# EAGLE design NinjaPool-171009 (EAGLE 6.6.0)
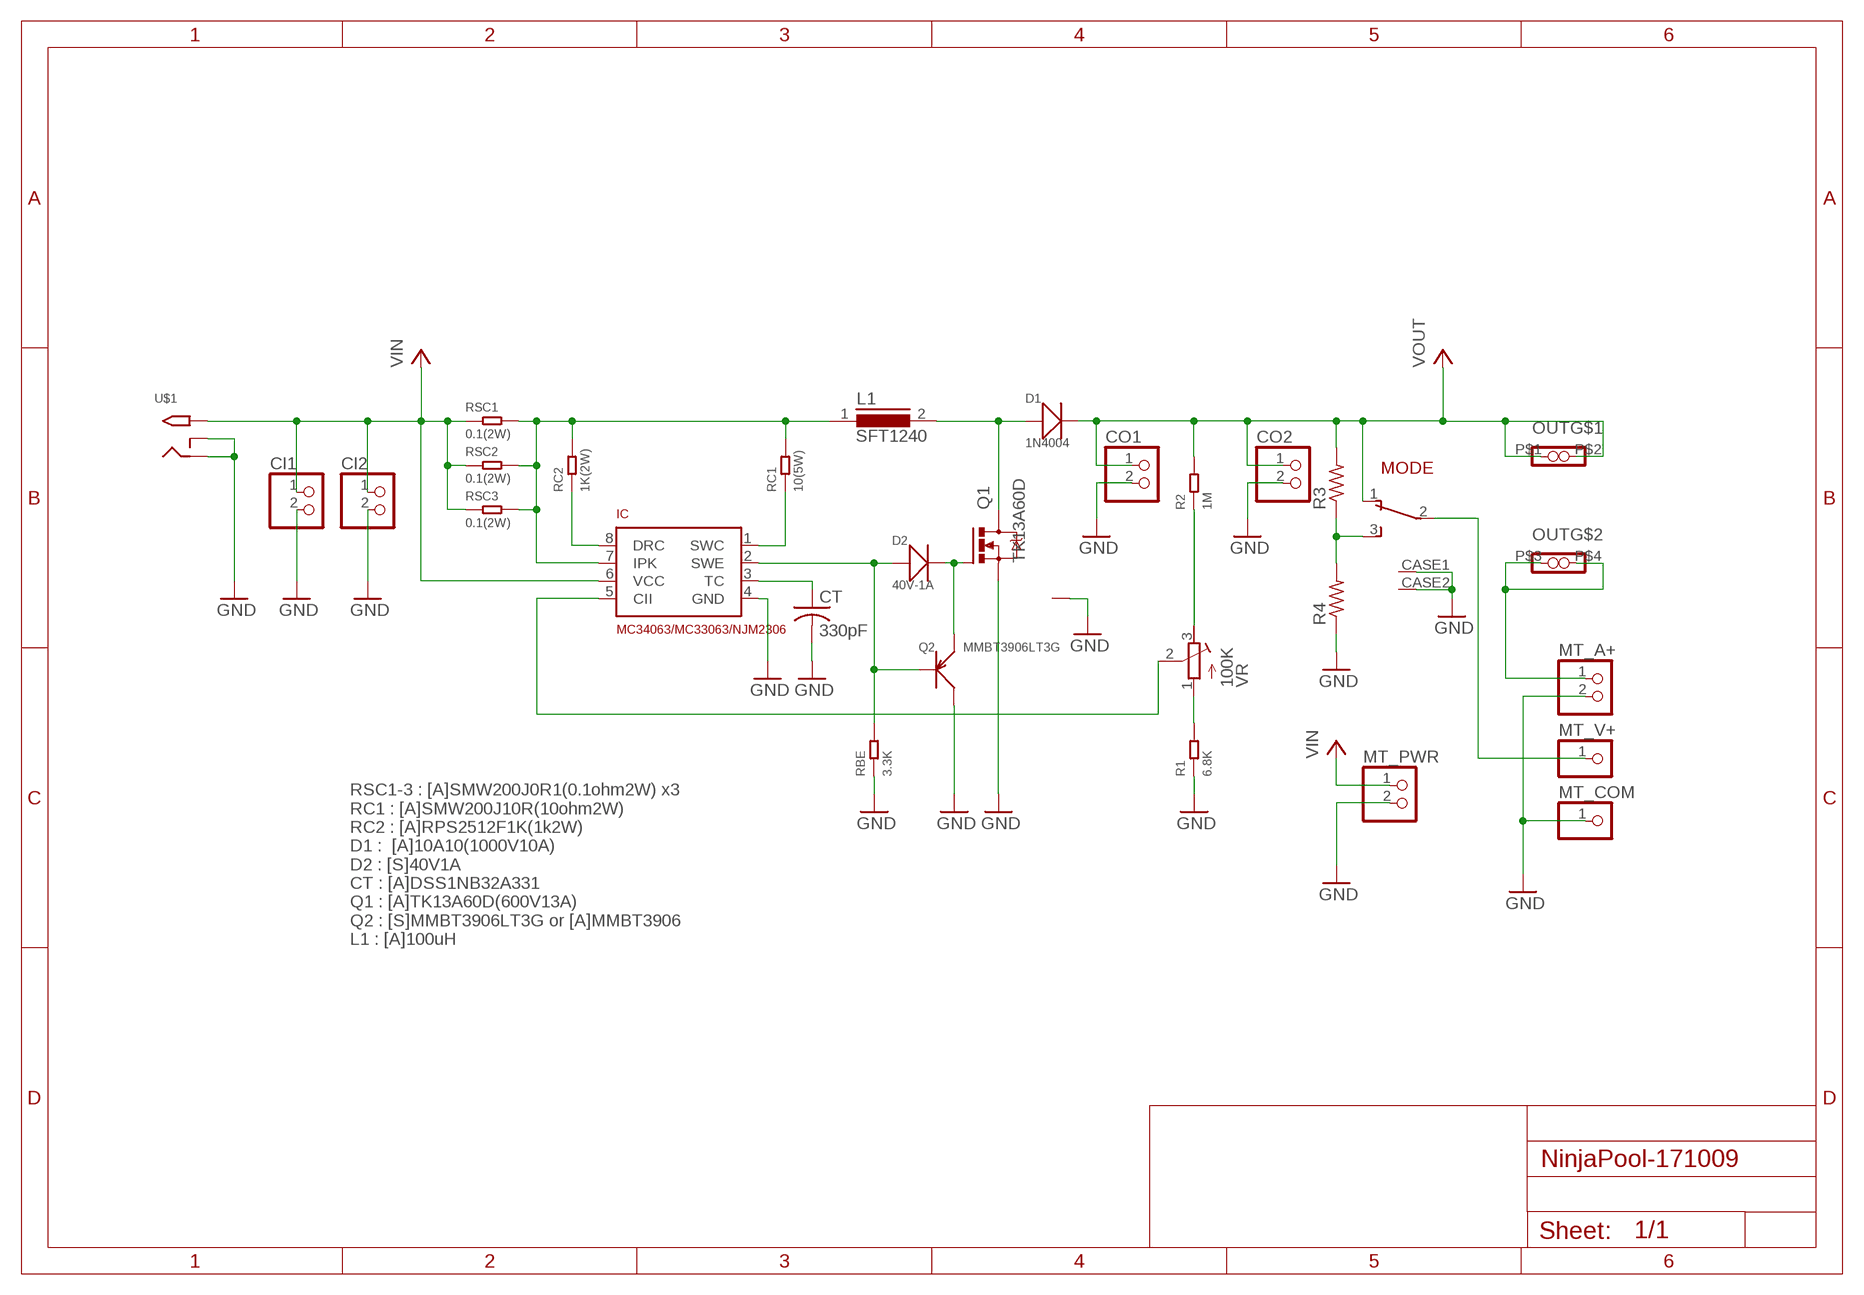
[diagram p0: schematic, sheet 1]

## Parts
CI1  PINHD-1X2  [1X02]
CI2  PINHD-1X2  [1X02]
CO1  PINHD-1X2  [1X02]
CO2  PINHD-1X2  [1X02]
CT  330pF  C-US050-024X044  [C050-024X044]
D1  1N4004  DIP-DIODE-400V-1A(DO-41)  [DO-41]
D2  40V-1A  SMD-DIODE-SCHOTTKY-40V-1A(DO-214AC)  [DO-214AC]
HEAT  HEAT111PB015  [HEAT11PB015]
IC  MC34063/MC33063/NJM2306  [DIL8]
L1  SFT1240  [SFT1240]
MODE  4MS1R202M6QES  [4MS1R202M6QES]
MT_A+  PINHD-1X2  [1X02]
MT_COM  PINHD-1X1  [1X01]
MT_PWR  PINHD-1X2  [1X02]
MT_V+  PINHD-1X1  [1X01]
OUT  BANANA  [BANANA_TMP]
Q1  TK13A60D  IRF520  [TO220BV]
Q2  MMBT3906LT3G  SMD-TRANSISTORS-PNP-40V-200MA-MMBT3906LT3G(SOT-23)  [SOT-23]
R1  6.8K  SMD-RES-6.8K-1%-1/10W(0603)  [R0603]
R2  1M  SMD-RES-1M-1%-1/10W(0603)  [R0603]
R3  R-US_R0603  [R0603]
R4  R-US_R0603  [R0603]
RBE  3.3K  SMD-RES-3.3K-5%-1/10W(0603)  [R0603]
RC1  10(5W)  SWE500  [SWE500]
RC2  1K(2W)  R2512  [R2512]
RSC1  0.1(2W)  SWE200  [SMW200]
RSC2  0.1(2W)  SWE200  [SMW200]
RSC3  0.1(2W)  SWE200  [SMW200]
U$1  2.1MMJACKTHM  [PJ-102A]
VR  100K  R-TRIMMAITENDO_R16K1  [AITENDO_R16K1]

## Nets
A+: MT_A+.1 OUT.P$3 OUT.P$4
GND: CI1.2 CI2.2 CO1.2 CO2.2 CT.2 HEAT.P$1 IC.4(GND) MODE.CASE1 MODE.CASE2 MT_A+.2 MT_COM.1 MT_PWR.2 Q1.S Q2.3(C) R1.1 R4.1 RBE.1 U$1.RING U$1.RING_SW
LIN: IC.7(IPK) L1.1 RC1.2 RC2.2 RSC1.2 RSC2.2 RSC3.2
N$1: R2.1 VR.3(E)
N$2: IC.8(DRC) RC2.1
N$3: IC.1(SWC) RC1.1
N$4: CT.1 IC.3(TC)
N$5: MODE.3 R3.1 R4.2
N$7: R1.2 VR.1(A)
N$8: IC.5(CII) VR.2(S)
N$9: MODE.2 MT_V+.1
Q1_DRAIN: D1.1(+) L1.2 Q1.D
Q1_GATE_Q2_COLLECT: D2.2(-) Q1.G Q2.2(E)
Q2_BASE: D2.1(+) IC.2(SWE) Q2.1(B) RBE.2
VIN: CI1.1 CI2.1 IC.6(VCC) MT_PWR.1 RSC1.1 RSC2.1 RSC3.1 U$1.TIP
VOUT: CO1.1 CO2.1 D1.2(-) MODE.1 OUT.P$1 OUT.P$2 R2.2 R3.2

## Notes on the sheet
- RSC1-3 : [A]SMW200J0R1(0.1ohm2W) x3
  RC1 : [A]SMW200J10R(10ohm2W)
  RC2 : [A]RPS2512F1K(1k2W)
  D1 :  [A]10A10(1000V10A)
  D2 : [S]40V1A
  CT : [A]DSS1NB32A331
  Q1 : [A]TK13A60D(600V13A)
  Q2 : [S]MMBT3906LT3G or [A]MMBT3906
  L1 : [A]100uH

## Library data of the parts
CI1 CI2 CO1 CO2 MT_A+ MT_PWR = pinhead:PINHD-1X2: PIN HEADER
CT = rcl:C-US: CAPACITOR, American symbol
D1 = Seeed-Diode:DIP-DIODE-400V-1A(DO-41): 304010008; MPN: 1N4004
D2 = Seeed-Diode:SMD-DIODE-SCHOTTKY-40V-1A(DO-214AC): 304020027; MPN: 1N5819
HEAT = PCR-Connector:HEAT1
IC = PCR-IC:MC34063/MC33063/NJM2306
L1 = inductors:SFT1240: INDUCTOR
MODE = PCR-Switch:4MS1R202M6QES
MT_COM MT_V+ = pinhead:PINHD-1X1: PIN HEADER
OUT = PCR-Connector:BANANA
Q1 = transistor-power:IRF520: HEXFET Power MOSFET
Q2 = Seeed-Transistor:SMD-TRANSISTORS-PNP-40V-200MA-MMBT3906LT3G(SOT-23): 305020002; MPN: MMBT3906LT3G
R1 = Seeed-Resistor:SMD-RES-6.8K-1%-1/10W(0603): 301010198; MPN: RC0805JR-07220KL
R2 = Seeed-Resistor:SMD-RES-1M-1%-1/10W(0603): 301010151; MPN: RC0603FR-071ML
R3 R4 = rcl:R-US_: RESISTOR, American symbol
RBE = Seeed-Resistor:SMD-RES-3.3K-5%-1/10W(0603): 301010112
RC1 RSC1-RSC3 = PCR-RCL:SWE
RC2 = PCR-RCL:R
U$1 = adafruit:2.1MMJACK: 2.1mm x 5.5mm THM DC jack with internal switch. Digikey part #PJ-102A, 4UCON part #05537 2.1mm x 5.5mm SMT DC jack with internal switch. Digikey part #PJ-002A-SMT, 4UCON part #03267 By microbuilder.eu & adafruit.com
VR = PCR-RCL:R-TRIMM

## Board
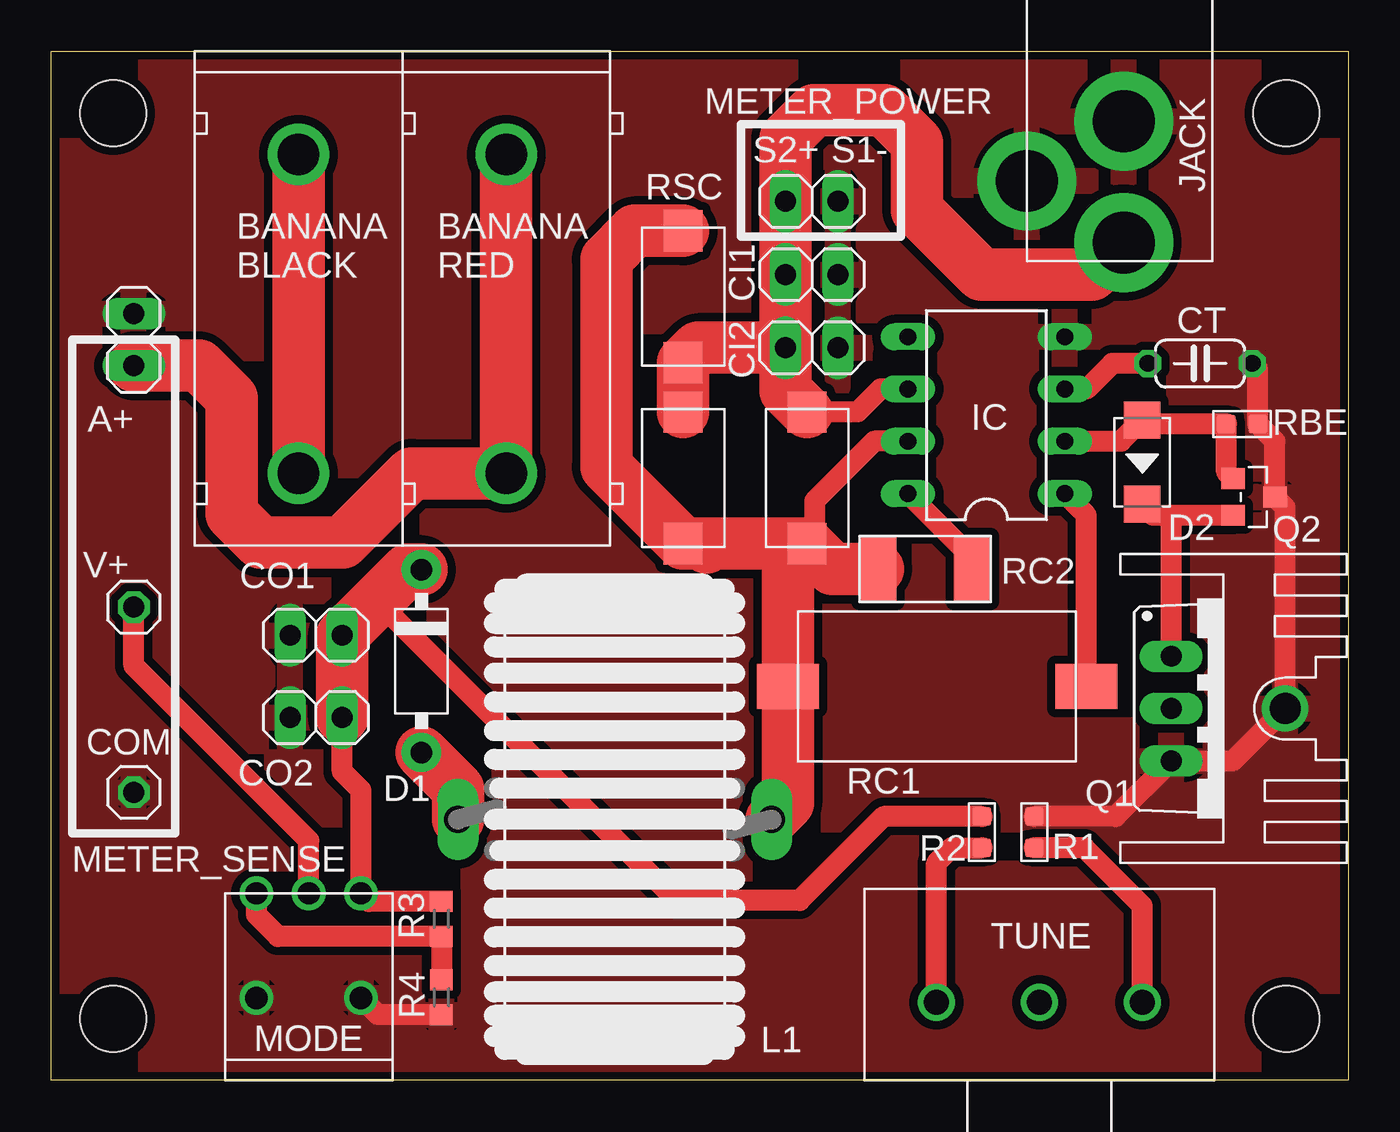
[diagram p1: board, top side]
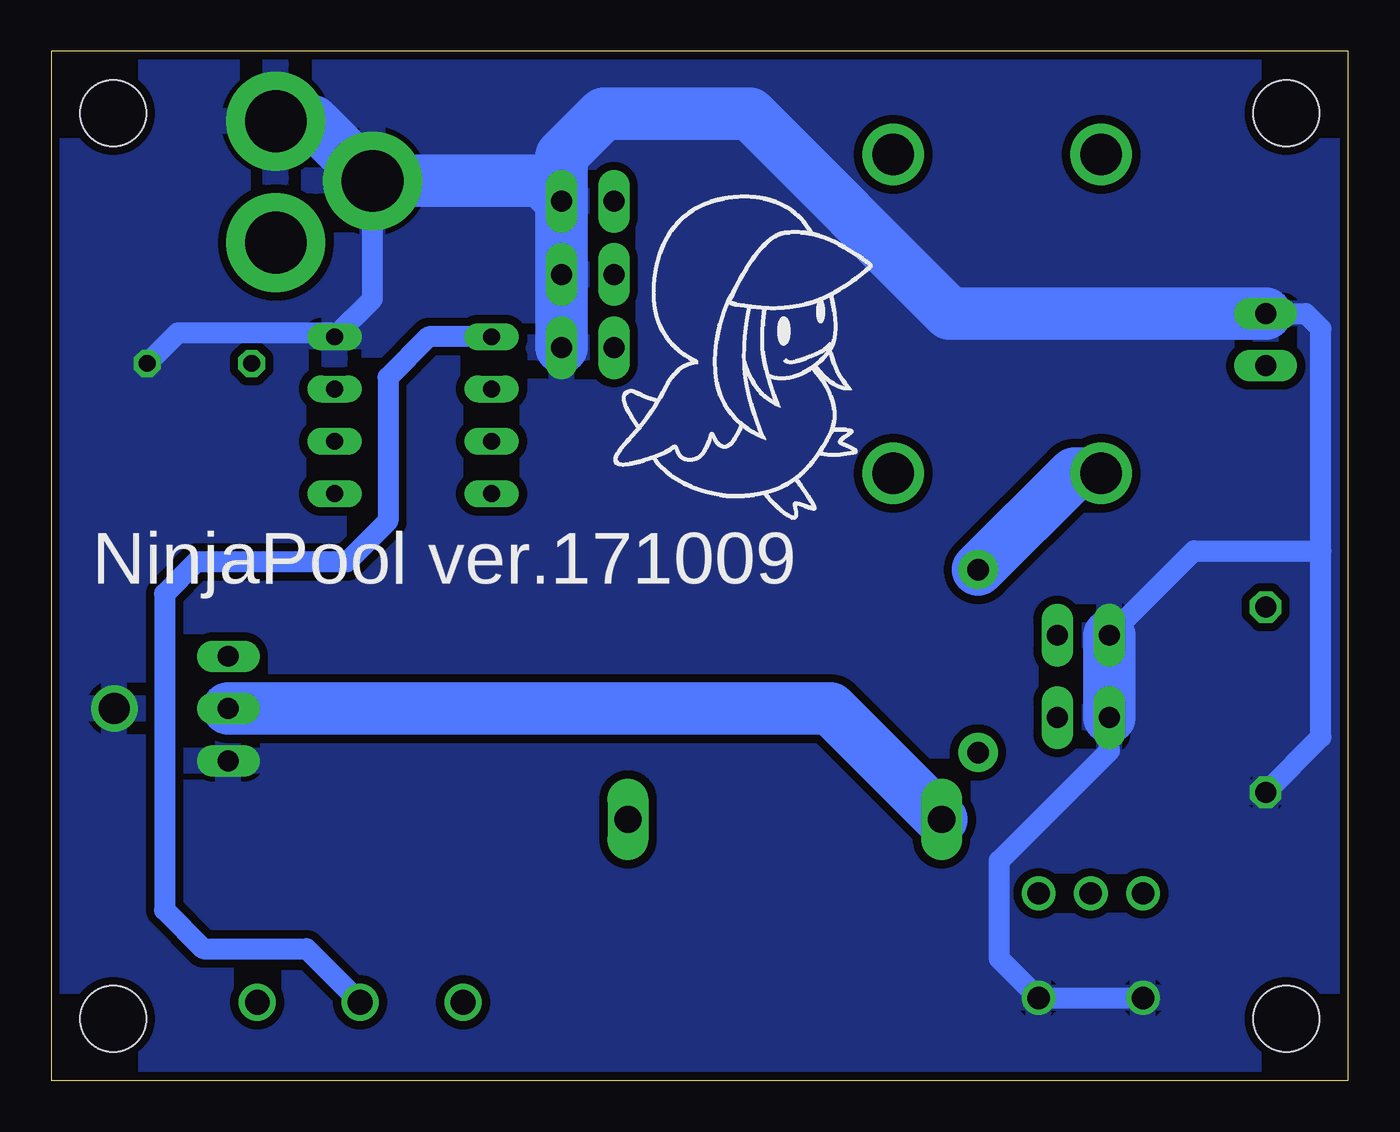
[diagram p2: board, bottom side, seen from below]

Size 63 x 50 mm. Coordinates in mm from the lower left corner, seen from the top.
Outline: 63,50 63,0 0,0 0,50 63,50
Copper layers (1*16): Top 0.035mm / dielectric 1.5mm / Bottom 0.035mm
Design rules "SeeedStudio_2layer_DRU_no_angle_20140221": minimum track width 6mil, minimum drill 12mil, track to track 6mil, track to pad 6mil, pad to pad 6mil, via to via 6mil, smd to smd 0mil, copper to edge 10mil, drill to drill 10mil, minimum pad ring 10mil, minimum via ring 6mil, stop-mask expansion 2mil, vias tented up to drill 100mil, thermal gap 10mil
Holes 3.2 mm at 3,3 60,3 60,47 3,47

### Footprints (pad centres in the part's own frame; a part is rotated, then mirrored left to right if it is on the bottom)
1X02 = drill 1.016 long: 1 -1.27,0; 2 1.27,0
C050-024X044 = drill 0.813 octagon: 1 -2.54,0; 2 2.54,0
DO-41 = drill 1.041 pad 1.905: 1 -4.445,0; 2 4.445,0
DO-214AC = smd 1.8 x 1.77: 1 -2.042,0; 2 2.042,0
HEAT11PB015 = drill 1.5: P$1 0,3
DIL8 = drill 0.813 long: 1 -3.81,-3.81; 2 -1.27,-3.81; 3 1.27,-3.81; 4 3.81,-3.81; 5 3.81,3.81; 6 1.27,3.81; 7 -1.27,3.81; 8 -3.81,3.81
SFT1240 = drill 1.321 long: 1 -7.62,0; 2 7.62,0
4MS1R202M6QES = drill 1.09: 1 2.54,9.09; 2 0,9.09; 3 -2.54,9.09; CASE1 2.54,4.01; CASE2 -2.54,4.01
1X01 = drill 1.016 octagon: 1 0,0
BANANA_TMP = drill 2: P$1 0,20.5; P$2 0,5; P$3 -10.1,20.5; P$4 -10.1,5
TO220BV = drill 1.016 long: D 0,-2.54; G -2.54,-2.54; S 2.54,-2.54
SOT-23 = smd 1.016 x 1.143: 1 -0.889,-1.016; 2 0.889,-1.016; 3 0,1.016
R0603 = smd 0.889 x 0.889: 1 0,0.762; 2 0,-0.762
R0603' = smd 1 x 1.1: 1 -0.85,0; 2 0.85,0
SWE500 = smd 3 x 2.2: 1 -7.25,0; 2 7.25,0
R2512 = smd 1.8 x 3.2: 1 -2.3,0; 2 2.3,0
SMW200 = smd 2 x 1.9: 1 -3.2,0; 2 3.2,0
PJ-102A = drill 3 pad 4.8: RING 0.1,-3.39; RING_SW -4.6,-6.29; TIP 0.1,-9.29
AITENDO_R16K1 = drill 1.2: 1 -5,0; 2 0,0; 3 5,0

### Placement (x,y rotation side)
CI1  36.94,39.16 0 top
CI2  36.94,35.6 0 top
CO1  12.86,21.63 180 top
CO2  12.86,17.63 180 top
CT  55.81,34.84 0 top
D1  17.97,20.38 90 top
D2  53,30.04 270 top
HEAT  56.94,18.07 270 top
IC  45.43,32.33 90 top
L1  27.37,12.68 180 top
MODE  12.5,0 0 top
MT_A+  4,36 90 top
MT_COM  4,14 0 top
MT_PWR  36.94,42.72 0 top
MT_V+  4,23 0 top
OUT  12,50 180 top
Q1  56.94,18.07 270 top
Q2  58.43,28.35 270 top
R1  47.75,12.06 0 top
R2  45.21,12.06 180 top
R3  [R0603']  18.95,7.85 90 top
R4  [R0603']  18.95,4.04 90 top
RBE  57.85,31.9 270 top
RC1  43.03,19.14 180 top
RC2  42.46,24.86 180 top
RSC1  36.72,29.28 270 top
RSC2  30.69,29.28 270 top
RSC3  30.69,38.08 90 top
U$1  52,50 0 top
U$3  [TORI_0.5]  36,27 0 bottom
VR  48,3.8 180 top

### Tracks (layer width: path | path; a pad name or v marks a point on that pad's centre or on a via)
A+
  Top 2.54: OUT.P$4 OUT.P$3 17.51,29.5 14.15,26.14 10.15,26.14 8.75,27.53 8.75,33.15 7.17,34.73 MT_A+.1
GND
  Top 1.016: CT.2 58.61,34.58 RBE.1 59.44,31.06 Q2.3 59.94,27.85 HEAT.P$1 57.4,15.53 Q1.S 51.7,12.83 R1.1 | R4.1 15.86,3.19 MODE.CASE1
  Bottom 1.016: U$1.RING_SW 47.4,37.98 IC.4 49.42,36.32 56.87,36.32 CT.2 | CO2.2 11.59,16.02 16.94,10.67 16.94,5.91 MODE.CASE1 MODE.CASE2 | MT_COM.1 1.32,16.68 1.32,25.73 | CO1.2 7.49,25.73 1.32,25.73 | MT_A+.2 2.07,37.27 1.32,36.52 1.32,25.73
  Bottom 2.54: U$1.RING 50.3,46.61 U$1.RING_SW 39.21,43.71 MT_PWR.2 | MT_PWR.2 CI1.2 CI2.2 | CO1.2 CO2.2 | MT_PWR.2 38.22,44.93 36.18,46.97 29.07,46.97 19.38,37.27 MT_A+.2
  pour Bottom (isolate 0.406): -1,51 64,51 64,-1 -1,-1
  pour Top (isolate 0.406): -2,52 65,52 65,-2 -2,-2
LIN
  Top 1.016: IC.7 39.98,31.06 37.08,28.15 37.08,25.71
  Top 2.54: RSC3.2 28.34,41.28 26.96,39.9 26.96,29.81 RSC2.2 31.64,26.08 | 31.64,26.08 RSC1.2 | 31.82,25.89 31.64,26.08 | RC2.2 37.94,24.86 37.47,25.33 37.08,25.71 RSC1.2 | RSC1.2 35.78,25.15 RC1.2 35.78,13.48 L1.1
N$1
  Top 1.016: VR.3 43,10.56 43.74,11.3 R2.1
N$2
  Top 1.016: RC2.1 44.76,25.38 IC.8
N$3
  Top 1.016: RC1.1 50.28,27.47 IC.1
N$4
  Top 1.016: CT.1 51.54,34.84 50.3,33.6 IC.3
N$5
  Top 1.016: R4.2 R3.1 11.01,7 9.96,8.05 MODE.3
N$7
  Top 1.016: VR.1 53,8.49 50.19,11.3 R1.2
N$8
  Bottom 1.016: IC.5 44.67,36.14 46.65,34.16 46.65,27.19 48.64,25.2 55.96,25.2 57.51,23.65 57.51,8.28 55.63,6.4 50.6,6.4 VR.2
N$9
  Top 1.016: MODE.2 12.5,11.65 4,20.16 MT_V+.1
Q1_DRAIN
  Top 2.54: D1.1 19.75,14.16 L1.2
  Bottom 2.54: Q1.D 25.14,18.07 L1.2
Q1_GATE_Q2_COLLECT
  Top 1.016: Q2.2 54.27,27.46 | 54.27,27.46 53.54,27.46 D2.2 | Q1.G 54.4,27.32 54.27,27.46
Q2_BASE
  Top 1.016: Q2.1 57.09,29.56 RBE.2 53.19,31.89 D2.1 51.97,31.06 IC.2
VIN
  Top 1.016: IC.6 40.29,33.6 39.17,32.48 RSC1.1
  Top 2.54: U$1.TIP 50.56,39.17 45.17,39.17 42.05,42.29 42.05,45.57 40.48,47.14 37.05,47.14 35.67,45.77 MT_PWR.1 CI1.1 CI2.1 | CI2.1 35.67,33.52 RSC1.1 | CI2.1 31.42,35.6 RSC3.1 RSC2.1
VOUT
  Top 1.016: CO2.1 14.13,15 15.04,14.09 MODE.1 15.43,8.7 R3.2 | R2.2 40.44,12.83 36.35,8.74 30.38,8.74 15.9,23.22 15.72,23.22
  Top 2.54: CO2.1 CO1.1 15.72,23.22 17.32,24.82 D1.2 | OUT.P$1 OUT.P$2
  Bottom 2.54: OUT.P$1 13.3,29.5 D1.2

### Text on the board
tPlace: METER_POWER | S2+ | S1- | RSC | JACK | BANANA / BLACK | BANANA / RED | A+ | V+ | COM | METER_SENSE | TUNE
bPlace: NinjaPool ver.171009